# Altium schematic sheet 0159_V0P82A and V1P05A_.SchDoc
size 848 x 558 mm
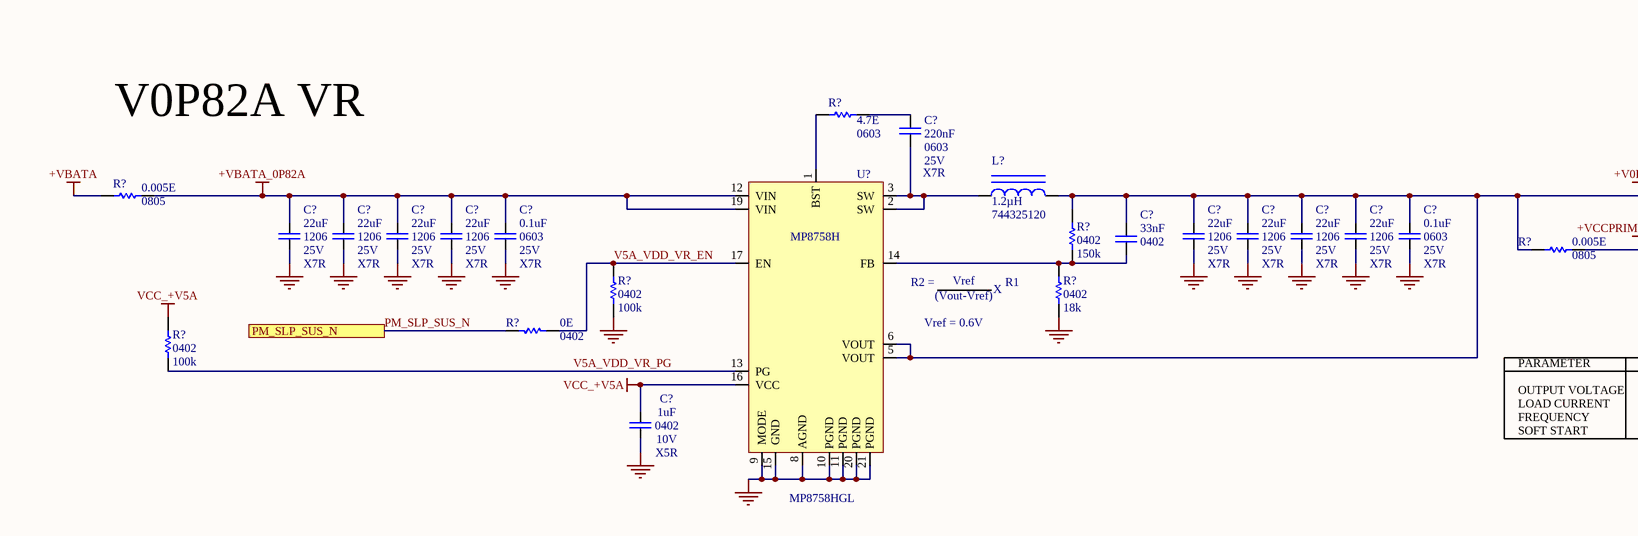
[diagram p0: 0159_V0P82A and V1P05A_.SchDoc, top left]
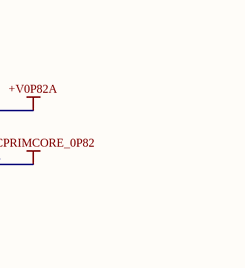
[diagram p1: 0159_V0P82A and V1P05A_.SchDoc, top middle]
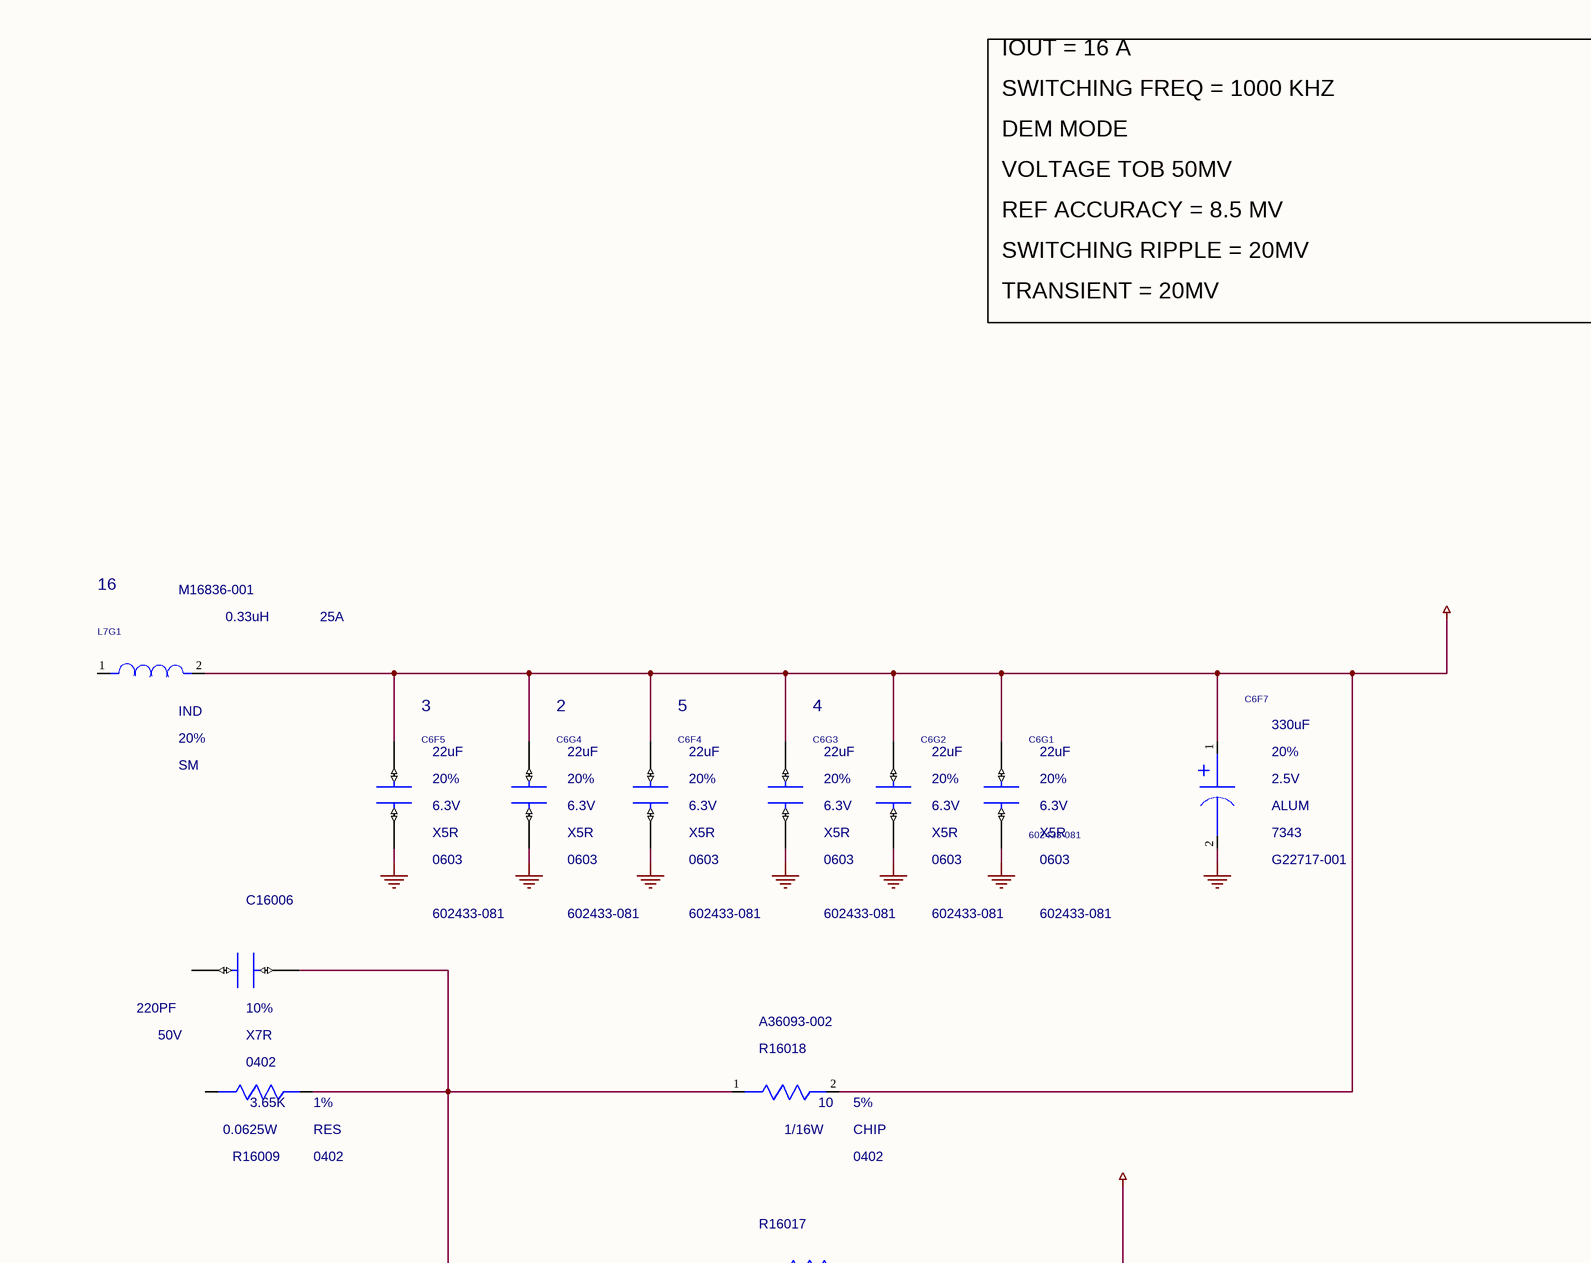
[diagram p2: 0159_V0P82A and V1P05A_.SchDoc, top right]
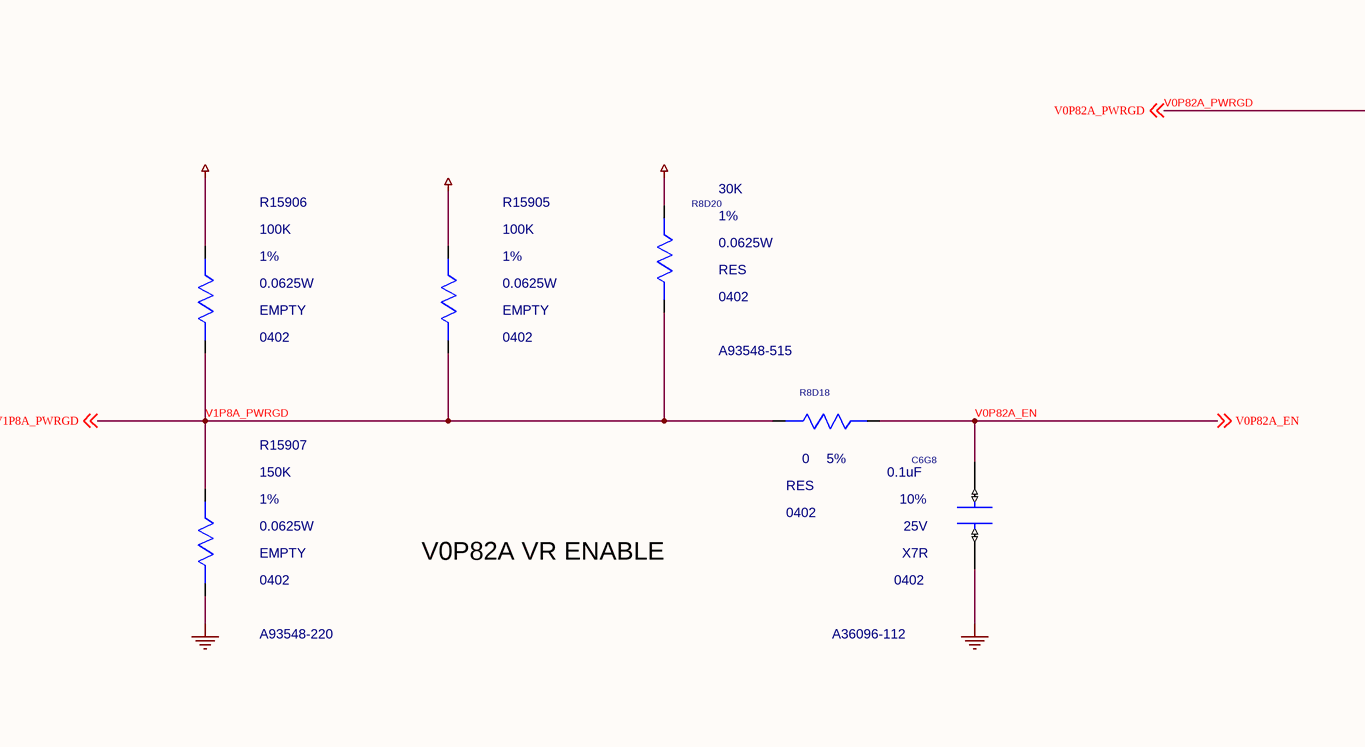
[diagram p3: 0159_V0P82A and V1P05A_.SchDoc, bottom left]
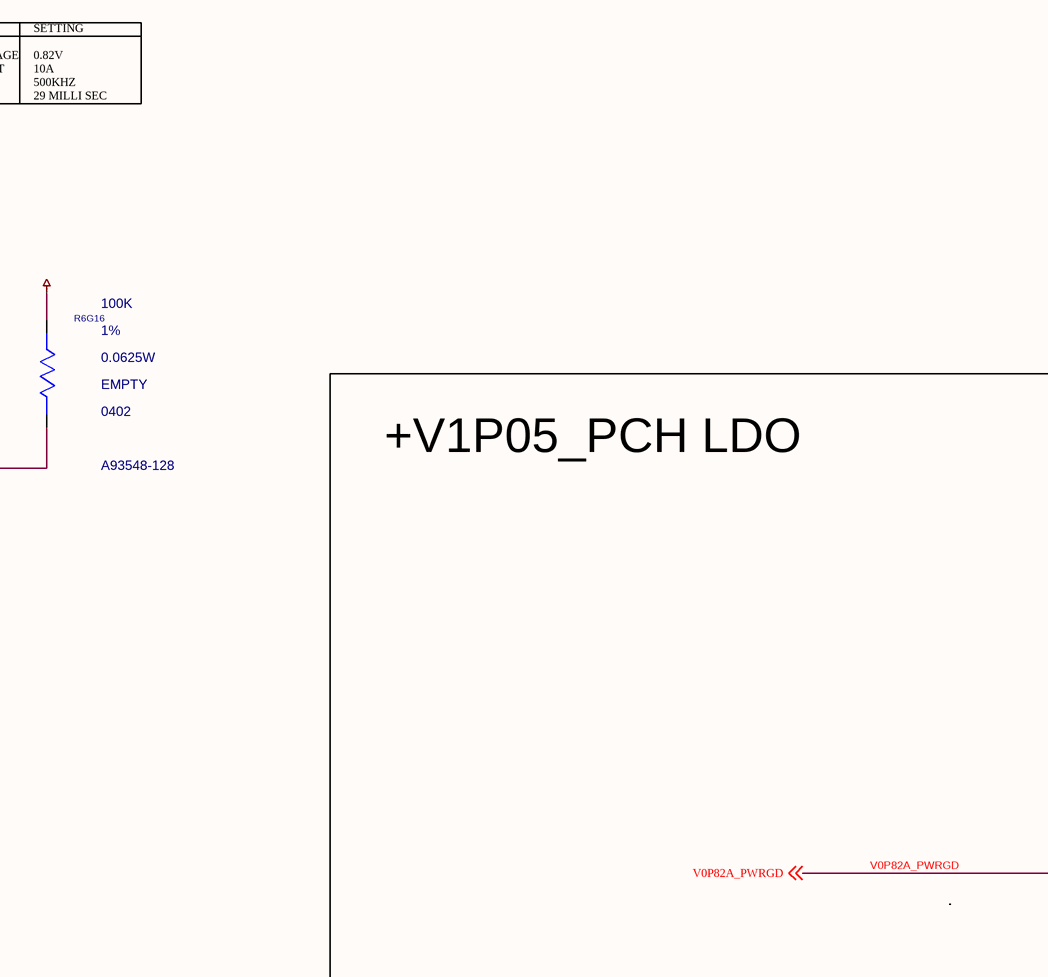
[diagram p4: 0159_V0P82A and V1P05A_.SchDoc, bottom middle]
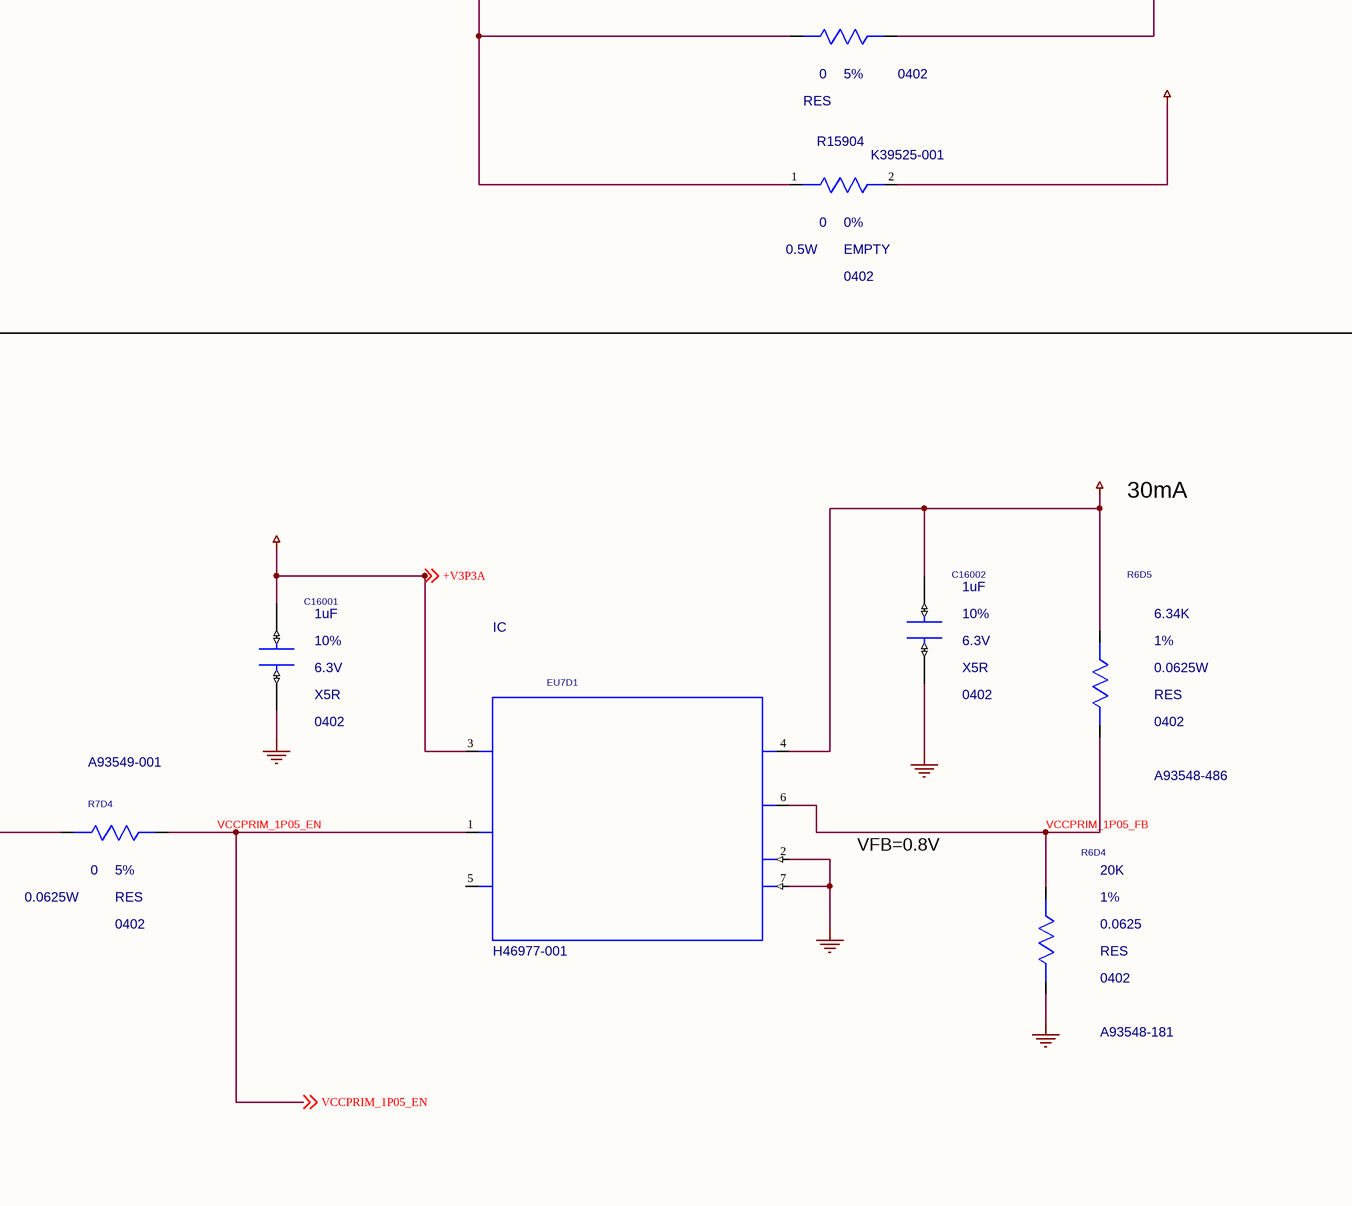
[diagram p5: 0159_V0P82A and V1P05A_.SchDoc, bottom right]

## Parts
(Parts that share a designator on the sheet are numbered #1, #2 ... from top to bottom, then left to right.)
C6F4  22uF  MATERIAL: X5R  PACK_TYPE: 0603  PART_NUMBER: 602433-081  TOLERANCE: 20%  VOLTAGE: 6.3V  REUSE_ID: 5  [CTK0_SM0603_1800X1000_MA]
C6F5  22uF  MATERIAL: X5R  PACK_TYPE: 0603  PART_NUMBER: 602433-081  TOLERANCE: 20%  VOLTAGE: 6.3V  REUSE_ID: 3  [CTK0_SM0603_1800X1000_MA]
C6F7  330uF  MATERIAL: ALUM  PACK_TYPE: 7343  PART_NUMBER: G22717-001  TOLERANCE: 20%  VOLTAGE: 2.5V  [TK0_SMC7343_7500X4500_ALEL_MA]
C6G1  22uF  MATERIAL: X5R  PACK_TYPE: 0603  PART_NUMBER: 602433-081  TOLERANCE: 20%  VOLTAGE: 6.3V  [CTK0_SM0603_1800X1000_MA]
C6G2  22uF  MATERIAL: X5R  PACK_TYPE: 0603  PART_NUMBER: 602433-081  TOLERANCE: 20%  VOLTAGE: 6.3V  [CTK0_SM0603_1800X1000_MA]
C6G3  22uF  MATERIAL: X5R  PACK_TYPE: 0603  PART_NUMBER: 602433-081  TOLERANCE: 20%  VOLTAGE: 6.3V  REUSE_ID: 4  [CTK0_SM0603_1800X1000_MA]
C6G4  22uF  MATERIAL: X5R  PACK_TYPE: 0603  PART_NUMBER: 602433-081  TOLERANCE: 20%  VOLTAGE: 6.3V  REUSE_ID: 2  [CTK0_SM0603_1800X1000_MA]
C6G8  0.1uF  MATERIAL: X7R  PACK_TYPE: 0402  PART_NUMBER: A36096-112  TOLERANCE: 10%  VOLTAGE: 25V  [CTK0_SM0402_1050X550_MA]
C16001  1uF  MATERIAL: X5R  PACK_TYPE: 0402  TOLERANCE: 10%  VOLTAGE: 6.3V  [CTK2_SM0402_1050X550_MA]
C16002  1uF  MATERIAL: X5R  PACK_TYPE: 0402  TOLERANCE: 10%  VOLTAGE: 6.3V  [CTK2_SM0402_1050X550_MA]
C16006  220PF  MATERIAL: X7R  PACK_TYPE: 0402  TOLERANCE: 10%  VOLTAGE: 50V  [CTK0_SM0402_1100X600_MA]
C?#1  value 220nF  Case/Package: 0603  Dielectric: X7R  Voltage: 25V  [CAPC0603]  (hidden comment: Cap)
C?#2  value 22uF  Case/Package: 1206  Voltage: 25V  Dielectric: X7R  [CAPC1206]
C?#3  value 22uF  Case/Package: 1206  Voltage: 25V  Dielectric: X7R  [CAPC1206]
C?#4  value 22uF  Case/Package: 1206  Voltage: 25V  Dielectric: X7R  [CAPC1206]
C?#5  value 22uF  Case/Package: 1206  Voltage: 25V  Dielectric: X7R  [CAPC1206]
C?#6  value 0.1uF  Case/Package: 0603  Voltage: 25V  Dielectric: X7R  [CAPC0603]
C?#7  value 22uF  Case/Package: 1206  Voltage: 25V  Dielectric: X7R  [CAPC1206]
C?#8  value 22uF  Case/Package: 1206  Voltage: 25V  Dielectric: X7R  [CAPC1206]
C?#9  value 22uF  Case/Package: 1206  Voltage: 25V  Dielectric: X7R  [CAPC1206]
C?#10  value 22uF  Case/Package: 1206  Voltage: 25V  Dielectric: X7R  [CAPC1206]
C?#11  value 0.1uF  Case/Package: 0603  Voltage: 25V  Dielectric: X7R  [CAPC0603]
C?#12  value 33nF  Case/Package: 0402  [CAPC0402]  (hidden comment: Cap)
C?#13  value 1uF  Case/Package: 0402  Voltage: 10V  Dielectric: X5R  [CAPC0402]
EU7D1  MATERIAL: IC  PART_NUMBER: H46977-001  [CTK0_LCC6_S2050_650_DF675X1225_MA]  (hidden comment: C_RT9053A_A)
L7G1  0.33uH  CURRENT: 25A  MATERIAL: IND  PACK_TYPE: SM  PART_NUMBER: M16836-001  TOLERANCE: 20%  REUSE_ID: 16  [CTK2_SM_7300X6800_MA]
L?  value 1.2µH  Manufacturer Part Number: 744325120  [IND-716530]  (hidden comment: C351096)
R6D4  20K  MATERIAL: RES  PACK_TYPE: 0402  PART_NUMBER: A93548-181  TOLERANCE: 1%  WATTAGE: 0.0625  [CTK0_SM0402_1100X550_MA]
R6D5  6.34K  MATERIAL: RES  PACK_TYPE: 0402  PART_NUMBER: A93548-486  TOLERANCE: 1%  WATTAGE: 0.0625W  [CTK0_SM0402_1100X550_MA]
R6G16  100K  MATERIAL: EMPTY  PACK_TYPE: 0402  PART_NUMBER: A93548-128  TOLERANCE: 1%  WATTAGE: 0.0625W  [CTK2_SM0402_1100X550_MA]
R7D4  0  MATERIAL: RES  PACK_TYPE: 0402  PART_NUMBER: A93549-001  TOLERANCE: 5%  WATTAGE: 0.0625W  [CTK0_SM0402_1100X550_MA]
R8D18  0  MATERIAL: RES  PACK_TYPE: 0402  TOLERANCE: 5%  [CTK0_SM0402_1100X550_MA]
R8D20  30K  MATERIAL: RES  PACK_TYPE: 0402  PART_NUMBER: A93548-515  TOLERANCE: 1%  WATTAGE: 0.0625W  [CTK0_SM0402_1100X550_MA]
R15904  0  MATERIAL: EMPTY  PACK_TYPE: 0402  PART_NUMBER: K39525-001  TOLERANCE: 0%  WATTAGE: 0.5W  [SMR0402ME]
R15905  100K  MATERIAL: EMPTY  PACK_TYPE: 0402  TOLERANCE: 1%  WATTAGE: 0.0625W  [CTK0_SM0402_1100X550_MA]
R15906  100K  MATERIAL: EMPTY  PACK_TYPE: 0402  TOLERANCE: 1%  WATTAGE: 0.0625W  [CTK0_SM0402_1100X550_MA]
R15907  150K  MATERIAL: EMPTY  PACK_TYPE: 0402  PART_NUMBER: A93548-220  TOLERANCE: 1%  WATTAGE: 0.0625W  [CTK2_SM0402_1100X550_MA]
R16009  3.65K  MATERIAL: RES  PACK_TYPE: 0402  TOLERANCE: 1%  WATTAGE: 0.0625W  [CTK2_SM0402_1100X550_MA]
R16017  0  MATERIAL: RES  PACK_TYPE: 0402  TOLERANCE: 5%  [CTK0_SM0402_1100X550_MA]
R16018  10  MATERIAL: CHIP  PACK_TYPE: 0402  PART_NUMBER: A36093-002  TOLERANCE: 5%  WATTAGE: 1/16W  [SMR0402IA]
R?#1  value 4.7E  Case/Package: 0603  [RESC0603]  (hidden comment: Res)
R?#2  value 0.005E  Case/Package: 0805  [RESC0805]  (hidden comment: Res)
R?#3  value 150k  Case/Package: 0402  [RESC0402]  (hidden comment: Res)
R?#4  value 0.005E  Case/Package: 0805  [RESC0805]  (hidden comment: Res)
R?#5  value 100k  Case/Package: 0402  [RESC0402]  (hidden comment: Res)
R?#6  value 18k  Case/Package: 0402  [RESC0402]  (hidden comment: Res)
R?#7  value 0E  Case/Package: 0402  [RESC0402]  (hidden comment: Res)
R?#8  value 100k  Case/Package: 0402  [RESC0402]  (hidden comment: Res)
U?  Manufacturer Part Number: MP8758HGL  [MP8758H_QFN-21 (3mmx4mm)]  (hidden comment: MP8758H)

## Ports
PM_SLP_SUS_N

## Nets
+V0P82A: C6F4.1(A) C6F5.1(A) C6F7.1(A) C6G1.1(A) C6G2.1(A) C6G3.1(A) C6G4.1(A) C?#7.2 C?#8.2 C?#9.2 C?#10.2 C?#11.2 C?#12.2 L7G1.2(INB) L?.2 R16018.2(B) R?#3.1 R?#4.1 U?.5(VOUT) U?.6(VOUT)
+V1P05A_PCH: C16002.1(A) EU7D1.4(VOUT) R6D5.1(A)
+V1P8A_SW_R: R15905.1(A)
+V1P8A_VCC: R15906.1(A)
+V3P3A: C16001.1(A) EU7D1.3(VIN) R6G16.1(A) R8D20.1(A) ; off-sheet +V3P3A
+VBATA: R?#2.1
+VBATA_0P82A: C?#2.2 C?#3.2 C?#4.2 C?#5.2 C?#6.2 R?#2.2 U?.12(VIN) U?.19(VIN)
+VCCHSIO_0P82: R15904.2(B)
+VCCPRIMCORE_0P82: R16017.2(B) R?#4.2
GND: C6F4.2(B) C6F5.2(B) C6F7.2(B) C6G1.2(B) C6G2.2(B) C6G3.2(B) C6G4.2(B) C6G8.2(B) C16001.2(B) C16002.2(B) C?#2.1 C?#3.1 C?#4.1 C?#5.1 C?#6.1 C?#7.1 C?#8.1 C?#9.1 C?#10.1 C?#11.1 C?#13.1 EU7D1.2(GND) EU7D1.7(GND_TPD) R6D4.2(B) R15907.2(B) R?#5.2 R?#6.2 U?.8(AGND) U?.9(MODE) U?.10(PGND) U?.11(PGND) U?.15(GND) U?.20(PGND) U?.21(PGND)
VCC_+V5A: C?#13.2 R?#8.1 U?.16(VCC)
PM_SLP_SUS_N: R?#7.2 ; port PM_SLP_SUS_N
UNNAMED_528_CCAP_I745_B: C16006.2(B) R15904.1(A) R16009.2(B) R16017.1(A) R16018.1(A)
V0P82A_EN: C6G8.1(A) R8D18.2(B) ; off-sheet V0P82A_EN
V0P82A_PWRGD: R6G16.2(B) R7D4.1(A) ; off-sheet V0P82A_PWRGD
V1P8A_PWRGD: R8D18.1(A) R8D20.2(B) R15905.2(B) R15906.2(B) R15907.1(A) ; off-sheet V1P8A_PWRGD
V5A_VDD_VR_EN: R?#5.1 R?#7.1 U?.17(EN)
V5A_VDD_VR_PG: R?#8.2 U?.13(PG)
VCCPRIM_1P05_EN: EU7D1.1(EN) R7D4.2(B) ; off-sheet VCCPRIM_1P05_EN
VCCPRIM_1P05_FB: EU7D1.6(FB) R6D4.1(A) R6D5.2(B)
NetC?#1_1: C?#1.1 L?.1 U?.2(SW) U?.3(SW)
NetC?#1_2: C?#1.2 R?#1.2
NetC?#12_1: C?#12.1 R?#3.2 R?#6.1 U?.14(FB)
NetR?#1_1: R?#1.1 U?.1(BST)

Not connected (* = marked no-connect by the designer): C16006 1(A); EU7D1 5(NC); L7G1 1(INA); R16009 1(A)

## Notes on the sheet
- SWITCHING FREQ = 1000 KHZ
- IOUT = 16 A
- VOLTAGE TOB 50MV
- DEM MODE
- REF ACCURACY = 8.5 MV
- SWITCHING RIPPLE = 20MV
- TRANSIENT = 20MV
- V0P82A VR
- (near U?) R2 =
- (near U?) Vref = 0.6V
- Vref
- (Vout-Vref)
- X
- (near R?#6) R1
- PARAMETER
- OUTPUT VOLTAGE
- LOAD CURRENT
- SETTING
- 10A
- 0.82V
- FREQUENCY
- SOFT START
- 500KHZ
- 29 MILLI SEC
- +V1P05_PCH LDO
- 30mA
- V0P82A VR ENABLE
- VFB=0.8V

## Library data of the parts
C6F4 = C_CAP: CDS_PHYS_PART_NAME: C_CAP_0603-602433-081,X5R,22UF,6.3V,20%,TK0,GENERIC; CDS_LMAN_SYM_OUTLINE: -50,50,50,-50; FP_TECH: TK0; IP: GENERIC; ROOM: NONE; OriginalSymbolOrigin: (-50,25); XY: (5975,-400); VER: 1; ROT: 0; PHYS_PAGE: 159; LOCATION: C6F4; DRAWING: @RVP1_ADL_SB_ADP_S_DDR5_SODIMM_2DPC_LIB.H55_DG2_2DPC(SCH_1):PAGE528; CDS_LIB: c_discrete; VARIANT: ?; PCB Footprint: CTK0_SM0603_1800X1000_MA; CHIPS_PART_NAME: C_CAP; CDS_PART_NAME: C_CAP_0603-602433-081,X5R,22UF,6.3V,20%,TK0,GENERIC; CDS_LOCATION: C6F4; ASI_MODEL: 602433-081
C6F5 = C_CAP: CDS_PHYS_PART_NAME: C_CAP_0603-602433-081,X5R,22UF,6.3V,20%,TK0,GENERIC; CDS_LMAN_SYM_OUTLINE: -50,50,50,-50; FP_TECH: TK0; IP: GENERIC; ROOM: NONE; OriginalSymbolOrigin: (-50,25); XY: (5500,-400); VER: 1; ROT: 0; PHYS_PAGE: 159; LOCATION: C6F5; DRAWING: @RVP1_ADL_SB_ADP_S_DDR5_SODIMM_2DPC_LIB.H55_DG2_2DPC(SCH_1):PAGE528; CDS_LIB: c_discrete; VARIANT: ?; PCB Footprint: CTK0_SM0603_1800X1000_MA; CHIPS_PART_NAME: C_CAP; CDS_PART_NAME: C_CAP_0603-602433-081,X5R,22UF,6.3V,20%,TK0,GENERIC; CDS_LOCATION: C6F5; ASI_MODEL: 602433-081
C6F7 = CAPP_2: CDS_PHYS_PART_NAME: CAPP_2_7343-G22717-001,ALUM,330UF,2.5V,20%,TK0,GENERIC; BOM_USE: STUFF; CDS_LMAN_SYM_OUTLINE: -50,100,50,-50; FP_TECH: TK0; IP: GENERIC; ROOM: NONE; OriginalSymbolOrigin: (-50,75); XY: (7025,-400); VER: 1; ROT: 0; PHYS_PAGE: 159; LOCATION: C6F7; DRAWING: @RVP1_ADL_SB_ADP_S_DDR5_SODIMM_2DPC_LIB.H55_DG2_2DPC(SCH_1):PAGE528; CDS_LIB: discrete_2; VARIANT: ?; PCB Footprint: TK0_SMC7343_7500X4500_ALEL_MA; CHIPS_PART_NAME: CAPP_2; CDS_PART_NAME: CAPP_2_7343-G22717-001,ALUM,330UF,2.5V,20%,TK0,GENERIC; CDS_LOCATION: C6F7; ASI_MODEL: G22717-001
C6G1 = C_CAP: CDS_PHYS_PART_NAME: C_CAP_0603-602433-081,X5R,22UF,6.3V,20%,TK0,GENERIC; CDS_LMAN_SYM_OUTLINE: -50,50,50,-50; FP_TECH: TK0; IP: GENERIC; ROOM: NONE; OriginalSymbolOrigin: (-50,25); XY: (6625,-400); VER: 1; ROT: 0; PHYS_PAGE: 159; LOCATION: C6G1; DRAWING: @RVP1_ADL_SB_ADP_S_DDR5_SODIMM_2DPC_LIB.H55_DG2_2DPC(SCH_1):PAGE528; CDS_LIB: c_discrete; VARIANT: ?; PCB Footprint: CTK0_SM0603_1800X1000_MA; CHIPS_PART_NAME: C_CAP; CDS_PART_NAME: C_CAP_0603-602433-081,X5R,22UF,6.3V,20%,TK0,GENERIC; CDS_LOCATION: C6G1; ASI_MODEL: 602433-081
C6G2 = C_CAP: CDS_PHYS_PART_NAME: C_CAP_0603-602433-081,X5R,22UF,6.3V,20%,TK0,GENERIC; CDS_LMAN_SYM_OUTLINE: -50,50,50,-50; FP_TECH: TK0; IP: GENERIC; ROOM: NONE; OriginalSymbolOrigin: (-50,25); XY: (6425,-400); VER: 1; ROT: 0; PHYS_PAGE: 159; LOCATION: C6G2; DRAWING: @RVP1_ADL_SB_ADP_S_DDR5_SODIMM_2DPC_LIB.H55_DG2_2DPC(SCH_1):PAGE528; CDS_LIB: c_discrete; VARIANT: ?; PCB Footprint: CTK0_SM0603_1800X1000_MA; CHIPS_PART_NAME: C_CAP; CDS_PART_NAME: C_CAP_0603-602433-081,X5R,22UF,6.3V,20%,TK0,GENERIC; CDS_LOCATION: C6G2; ASI_MODEL: 602433-081
C6G3 = C_CAP: CDS_PHYS_PART_NAME: C_CAP_0603-602433-081,X5R,22UF,6.3V,20%,TK0,GENERIC; CDS_LMAN_SYM_OUTLINE: -50,50,50,-50; FP_TECH: TK0; IP: GENERIC; ROOM: NONE; OriginalSymbolOrigin: (-50,25); XY: (6225,-400); VER: 1; ROT: 0; PHYS_PAGE: 159; LOCATION: C6G3; DRAWING: @RVP1_ADL_SB_ADP_S_DDR5_SODIMM_2DPC_LIB.H55_DG2_2DPC(SCH_1):PAGE528; CDS_LIB: c_discrete; VARIANT: ?; PCB Footprint: CTK0_SM0603_1800X1000_MA; CHIPS_PART_NAME: C_CAP; CDS_PART_NAME: C_CAP_0603-602433-081,X5R,22UF,6.3V,20%,TK0,GENERIC; CDS_LOCATION: C6G3; ASI_MODEL: 602433-081
C6G4 = C_CAP: CDS_PHYS_PART_NAME: C_CAP_0603-602433-081,X5R,22UF,6.3V,20%,TK0,GENERIC; CDS_LMAN_SYM_OUTLINE: -50,50,50,-50; FP_TECH: TK0; IP: GENERIC; ROOM: NONE; OriginalSymbolOrigin: (-50,25); XY: (5750,-400); VER: 1; ROT: 0; PHYS_PAGE: 159; LOCATION: C6G4; DRAWING: @RVP1_ADL_SB_ADP_S_DDR5_SODIMM_2DPC_LIB.H55_DG2_2DPC(SCH_1):PAGE528; CDS_LIB: c_discrete; VARIANT: ?; PCB Footprint: CTK0_SM0603_1800X1000_MA; CHIPS_PART_NAME: C_CAP; CDS_PART_NAME: C_CAP_0603-602433-081,X5R,22UF,6.3V,20%,TK0,GENERIC; CDS_LOCATION: C6G4; ASI_MODEL: 602433-081
C6G8 = C_CAP: CDS_PHYS_PART_NAME: C_CAP_0402-A36096-112,X7R,0.1UF,25V,10%,TK0,GENERIC; CDS_LMAN_SYM_OUTLINE: -50,50,50,-50; FP_TECH: TK0; IP: GENERIC; ROOM: NONE; OriginalSymbolOrigin: (-50,25); XY: (2125,-2750); VER: 1; ROT: 2; PHYS_PAGE: 159; LOCATION: C6G8; DRAWING: @RVP1_ADL_SB_ADP_S_DDR5_SODIMM_2DPC_LIB.H55_DG2_2DPC(SCH_1):PAGE528; CDS_LIB: c_discrete; VARIANT: ?; PCB Footprint: CTK0_SM0402_1050X550_MA; CHIPS_PART_NAME: C_CAP; CDS_PART_NAME: C_CAP_0402-A36096-112,X7R,0.1UF,25V,10%,TK0,GENERIC; CDS_LOCATION: C6G8; ASI_MODEL: A36096-112
C16001 = C_CAP: PART_NUMBER: A36096-027; CDS_PHYS_PART_NAME: CAP_402-1UF,10%,16V"; CDS_PART_NAME: C_CAP_0402-A36096-027,X5R,1UF,6.3V,10%,TK2,GENERIC; CDS_LMAN_SYM_OUTLINE: -50,50,50,-50; FP_TECH: TK2; IP: GENERIC; ROOM: NONE; OriginalSymbolOrigin: (-50,25); XY: (5225,-2425); VER: 1; ROT: 0; PHYS_PAGE: 159; LOCATION: C16001; DRAWING: @RVP1_ADL_SB_ADP_S_DDR5_SODIMM_2DPC_LIB.H55_DG2_2DPC(SCH_1):PAGE528; CDS_LIB: c_discrete; VARIANT: ?; PCB Footprint: CTK2_SM0402_1050X550_MA; CHIPS_PART_NAME: C_CAP; CDS_LOCATION: C16001; ASI_MODEL: A36096-027
C16002 = C_CAP: PART_NUMBER: A36096-027; CDS_PHYS_PART_NAME: CAP_402-1UF,10%,16V"; CDS_PART_NAME: C_CAP_0402-A36096-027,X5R,1UF,6.3V,10%,TK2,GENERIC; CDS_LMAN_SYM_OUTLINE: -50,50,50,-50; FP_TECH: TK2; IP: GENERIC; ROOM: NONE; OriginalSymbolOrigin: (-50,25); XY: (6425,-2375); VER: 1; ROT: 0; PHYS_PAGE: 159; LOCATION: C16002; DRAWING: @RVP1_ADL_SB_ADP_S_DDR5_SODIMM_2DPC_LIB.H55_DG2_2DPC(SCH_1):PAGE528; CDS_LIB: c_discrete; VARIANT: ?; PCB Footprint: CTK2_SM0402_1050X550_MA; CHIPS_PART_NAME: C_CAP; CDS_LOCATION: C16002; ASI_MODEL: A36096-027
C16006 = C_CAP#1: PART_NUMBER: A36096-002; CHIPS_PART_NAME: C_CAP; CDS_PHYS_PART_NAME: C_CAP_0402-A36096-002,X7R,220PF,50V,10%,TK0,GENERIC; CDS_LMAN_SYM_OUTLINE: -50,50,50,-50; FP_TECH: TK0; IP: GENERIC; ROOM: NONE; OriginalSymbolOrigin: (-25,50); XY: (5225,-725); VER: 2; ROT: 0; PHYS_PAGE: 159; LOCATION: C16006; DRAWING: @RVP1_ADL_SB_ADP_S_DDR5_SODIMM_2DPC_LIB.H55_DG2_2DPC(SCH_1):PAGE528; CDS_LIB: c_discrete; VARIANT: ?; PCB Footprint: CTK0_SM0402_1100X600_MA; CDS_PART_NAME: C_CAP_0402-A36096-002,X7R,220PF,50V,10%,TK0,GENERIC; CDS_LOCATION: C16006
C?#1 = Cap: CAP CER 220nF 25V X7R 0603; Manufacturer Part Number: GRM188R71E224KA88D
C?#2-C?#5 C?#7-C?#10 = Cap: CAP CER 22uF 25V X7R 1206; Manufacturer Part Number: CL31A226KAHNNNE
C?#6 C?#11 = Cap: CAP CER 0.1uF 25V X7R 0603; Manufacturer Part Number: CL10B104KA8NNND
C?#12 = Cap: CAP CER 33nF 25V X7R 0402; Manufacturer Part Number: C0402C333K3REC; Dielectric: X7R; Voltage: 25V
C?#13 = Cap: CAP CER 1uF 10V X5R 0402
EU7D1 = C_RT9053A_A: CDS_PHYS_PART_NAME: C_RT9053A_A_LCC-H46977-001,IC,RT9053AZQW,TK0,GENERIC; CDS_LMAN_SYM_OUTLINE: -250,250,250,-200; FP_TECH: TK0; IP: GENERIC; PACK_TYPE: LCC; ROOM: NONE; OriginalSymbolOrigin: (-275,250); XY: (5875,-2750); VER: 1; ROT: 0; PHYS_PAGE: 159; LOCATION: EU7D1; DRAWING: @RVP1_ADL_SB_ADP_S_DDR5_SODIMM_2DPC_LIB.H55_DG2_2DPC(SCH_1):PAGE528; CDS_LIB: local; VARIANT: ?; PCB Footprint: CTK0_LCC6_S2050_650_DF675X1225_MA; SEC_TYPE: LCC; CHIPS_PART_NAME: C_RT9053A_A; CDS_PART_NAME: C_RT9053A_A_LCC-H46977-001,IC,RT9053AZQW,TK0,GENERIC; CDS_LOCATION: EU7D1; ASI_MODEL: H46977-001
L7G1 = C_INDUCTOR: CDS_PHYS_PART_NAME: C_INDUCTOR_SM-M16836-001,IND,0.33UH,20%,25A,TK2,GENERIC; CDS_LMAN_SYM_OUTLINE: -100,50,100,-50; FP_TECH: TK2; IP: GENERIC; ROOM: NONE; OriginalSymbolOrigin: (-75,25); XY: (5050,-175); VER: 1; ROT: 0; PHYS_PAGE: 159; LOCATION: L7G1; DRAWING: @RVP1_ADL_SB_ADP_S_DDR5_SODIMM_2DPC_LIB.H55_DG2_2DPC(SCH_1):PAGE528; CDS_LIB: local; VARIANT: ?; PCB Footprint: CTK2_SM_7300X6800_MA; CHIPS_PART_NAME: C_INDUCTOR; CDS_PART_NAME: C_INDUCTOR_SM-M16836-001,IND,0.33UH,20%,25A,TK2,GENERIC; CDS_LOCATION: L7G1; ASI_MODEL: M16836-001
L? = Inductor: Power Inductors 1.2uH, 20A,1.8mΩ,111005; Case/Package: IND-11mm×10.2mm
R6D4 = C_RES: CDS_PHYS_PART_NAME: C_RES_0402-A93548-181,RES,20K,1%,0.0625,TK0,GENERIC; CDS_LMAN_SYM_OUTLINE: -50,50,50,-50; FP_TECH: TK0; IP: GENERIC; ROOM: NONE; OriginalSymbolOrigin: (-25,75); XY: (6650,-2950); VER: 2; ROT: 0; PHYS_PAGE: 159; LOCATION: R6D4; DRAWING: @RVP1_ADL_SB_ADP_S_DDR5_SODIMM_2DPC_LIB.H55_DG2_2DPC(SCH_1):PAGE528; CDS_LIB: c_discrete; VARIANT: ?; PCB Footprint: CTK0_SM0402_1100X550_MA; SEC_TYPE: 0402; CHIPS_PART_NAME: C_RES; CDS_PART_NAME: C_RES_0402-A93548-181,RES,20K,1%,0.0625,TK0,GENERIC; CDS_LOCATION: R6D4; ASI_MODEL: A93548-181
R6D5 = C_RES: CDS_PHYS_PART_NAME: C_RES_0402-A93548-486,RES,6.34K,1%,0.0625W,TK0,GENERIC; CDS_LMAN_SYM_OUTLINE: -50,50,50,-50; FP_TECH: TK0; IP: GENERIC; ROOM: NONE; OriginalSymbolOrigin: (-25,75); XY: (6750,-2475); VER: 2; ROT: 0; PHYS_PAGE: 159; LOCATION: R6D5; DRAWING: @RVP1_ADL_SB_ADP_S_DDR5_SODIMM_2DPC_LIB.H55_DG2_2DPC(SCH_1):PAGE528; CDS_LIB: c_discrete; VARIANT: ?; PCB Footprint: CTK0_SM0402_1100X550_MA; SEC_TYPE: 0402; CHIPS_PART_NAME: C_RES; CDS_PART_NAME: C_RES_0402-A93548-486,RES,6.34K,1%,0.0625W,TK0,GENERIC; CDS_LOCATION: R6D5; ASI_MODEL: A93548-486
R6G16 = C_RES: CDS_PHYS_PART_NAME: C_RES_0402-A93548-128,EMPTY,100K,1%,0.0625W,TK2,GENERIC; CDS_LMAN_SYM_OUTLINE: -50,50,50,-50; FP_TECH: TK2; IP: GENERIC; ROOM: NONE; OriginalSymbolOrigin: (-25,75); XY: (2875,-1825); VER: 2; ROT: 0; PHYS_PAGE: 159; LOCATION: R6G16; DRAWING: @RVP1_ADL_SB_ADP_S_DDR5_SODIMM_2DPC_LIB.H55_DG2_2DPC(SCH_1):PAGE528; CDS_LIB: c_discrete; VARIANT: ?; PCB Footprint: CTK2_SM0402_1100X550_MA; CHIPS_PART_NAME: C_RES; CDS_PART_NAME: C_RES_0402-A93548-128,EMPTY,100K,1%,0.0625W,TK2,GENERIC; CDS_LOCATION: R6G16; ASI_MODEL: A93548-128
R7D4 = C_RES#1: CHIPS_PART_NAME: C_RES; CDS_PHYS_PART_NAME: C_RES_0402-A93549-001,RES,0,5%,0.0625W,TK0,GENERIC; CDS_LMAN_SYM_OUTLINE: -50,50,50,-50; FP_TECH: TK0; IP: GENERIC; ROOM: NONE; OriginalSymbolOrigin: (-75,25); XY: (4925,-2750); VER: 1; PHYS_PAGE: 159; LOCATION: R7D4; DRAWING: @RVP1_ADL_SB_ADP_S_DDR5_SODIMM_2DPC_LIB.H55_DG2_2DPC(SCH_1):PAGE528; CDS_LIB: c_discrete; VARIANT: ?; PCB Footprint: CTK0_SM0402_1100X550_MA; SEC_TYPE: 0402; ROT: 0; CDS_PART_NAME: C_RES_0402-A93549-001,RES,0,5%,0.0625W,TK0,GENERIC; CDS_LOCATION: R7D4; ASI_MODEL: A93549-001
R8D18 = C_RES#1: PART_NUMBER: A93549-001; CHIPS_PART_NAME: C_RES; CDS_PHYS_PART_NAME: RES_402-0,5%,402"; CDS_PART_NAME: C_RES_0402-A93549-001,RES,0,5%,0.0625W,TK0,GENERIC; CDS_LMAN_SYM_OUTLINE: -50,50,50,-50; FP_TECH: TK0; IP: GENERIC; ROOM: NONE; WATTAGE: 0.0625W; OriginalSymbolOrigin: (-75,25); XY: (1850,-2575); VER: 1; PHYS_PAGE: 159; LOCATION: R8D18; DRAWING: @RVP1_ADL_SB_ADP_S_DDR5_SODIMM_2DPC_LIB.H55_DG2_2DPC(SCH_1):PAGE528; CDS_LIB: c_discrete; VARIANT: ?; PCB Footprint: CTK0_SM0402_1100X550_MA; SEC_TYPE: 0402; ROT: 0; CDS_LOCATION: R8D18; ASI_MODEL: A93549-001
R8D20 = C_RES: CDS_PHYS_PART_NAME: RES_402-22K,5%,402"; CDS_PART_NAME: C_RES_0402-A93548-515,RES,30K,1%,0.0625W,TK0,GENERIC; CDS_LMAN_SYM_OUTLINE: -50,50,50,-50; FP_TECH: TK0; IP: GENERIC; ROOM: NONE; OriginalSymbolOrigin: (-25,75); XY: (1550,-2275); VER: 2; ROT: 0; PHYS_PAGE: 159; LOCATION: R8D20; DRAWING: @RVP1_ADL_SB_ADP_S_DDR5_SODIMM_2DPC_LIB.H55_DG2_2DPC(SCH_1):PAGE528; CDS_LIB: c_discrete; BOM: GLUE_OPTION; VARIANT: ?; PCB Footprint: CTK0_SM0402_1100X550_MA; SEC_TYPE: 0402; CHIPS_PART_NAME: C_RES; CDS_LOCATION: R8D20; ASI_MODEL: A93548-515
R15904 = RES#1: CHIPS_PART_NAME: RES; CDS_PHYS_PART_NAME: RES_0402-K39525-001,EMPTY,0,0%,0.5W,LPDB,GENERIC; OriginalSymbolOrigin: (-75,25); XY: (6275,-1550); VER: 1; PHYS_PAGE: 159; LOCATION: R15904; IP: GENERIC; FP_TECH: LPDB; DRAWING: @RVP1_ADL_SB_ADP_S_DDR5_SODIMM_2DPC_LIB.H55_DG2_2DPC(SCH_1):PAGE528; CDS_LIB: discrete; PCB Footprint: SMR0402ME; ROT: 0; CDS_PART_NAME: RES_0402-K39525-001,EMPTY,0,0%,0.5W,LPDB,GENERIC; CDS_LOCATION: R15904
R15905 = C_RES: PART_NUMBER: A93548-128; CDS_PHYS_PART_NAME: C_RES_0402-A93548-128,EMPTY,100K,1%,0.0625W,TK0,GENERIC; CDS_LMAN_SYM_OUTLINE: -50,50,50,-50; FP_TECH: TK0; IP: GENERIC; ROOM: NONE; OriginalSymbolOrigin: (-25,75); XY: (1150,-2350); VER: 2; ROT: 0; PHYS_PAGE: 159; LOCATION: R15905; DRAWING: @RVP1_ADL_SB_ADP_S_DDR5_SODIMM_2DPC_LIB.H55_DG2_2DPC(SCH_1):PAGE528; CDS_LIB: c_discrete; VARIANT: ?; PCB Footprint: CTK0_SM0402_1100X550_MA; CHIPS_PART_NAME: C_RES; CDS_PART_NAME: C_RES_0402-A93548-128,EMPTY,100K,1%,0.0625W,TK0,GENERIC; CDS_LOCATION: R15905; ASI_MODEL: A93548-128
R15906 = C_RES: PART_NUMBER: A93548-128; CDS_PHYS_PART_NAME: C_RES_0402-A93548-128,EMPTY,100K,1%,0.0625W,TK0,GENERIC; CDS_LMAN_SYM_OUTLINE: -50,50,50,-50; FP_TECH: TK0; IP: GENERIC; ROOM: NONE; OriginalSymbolOrigin: (-25,75); XY: (700,-2350); VER: 2; ROT: 0; PHYS_PAGE: 159; LOCATION: R15906; DRAWING: @RVP1_ADL_SB_ADP_S_DDR5_SODIMM_2DPC_LIB.H55_DG2_2DPC(SCH_1):PAGE528; CDS_LIB: c_discrete; VARIANT: ?; PCB Footprint: CTK0_SM0402_1100X550_MA; CHIPS_PART_NAME: C_RES; CDS_PART_NAME: C_RES_0402-A93548-128,EMPTY,100K,1%,0.0625W,TK0,GENERIC; CDS_LOCATION: R15906; ASI_MODEL: A93548-128
R15907 = C_RES: CDS_PHYS_PART_NAME: C_RES_0402-A93548-220,EMPTY,150K,1%,0.0625W,TK2,GENERIC; CDS_LMAN_SYM_OUTLINE: -50,50,50,-50; FP_TECH: TK2; IP: GENERIC; ROOM: NONE; OriginalSymbolOrigin: (-25,75); XY: (700,-2800); VER: 2; ROT: 0; PHYS_PAGE: 159; LOCATION: R15907; DRAWING: @RVP1_ADL_SB_ADP_S_DDR5_SODIMM_2DPC_LIB.H55_DG2_2DPC(SCH_1):PAGE528; CDS_LIB: c_discrete; VARIANT: ?; PCB Footprint: CTK2_SM0402_1100X550_MA; CHIPS_PART_NAME: C_RES; CDS_PART_NAME: C_RES_0402-A93548-220,EMPTY,150K,1%,0.0625W,TK2,GENERIC; CDS_LOCATION: R15907
R16009 = C_RES#1: PART_NUMBER: A93548-065; CHIPS_PART_NAME: C_RES; CDS_PHYS_PART_NAME: C_RES_0402-A93548-065,RES,3.65K,1%,0.0625W,TK2,GENERIC; CDS_LMAN_SYM_OUTLINE: -50,50,50,-50; FP_TECH: TK2; IP: GENERIC; ROOM: NONE; OriginalSymbolOrigin: (-75,25); XY: (5250,-950); VER: 1; ROT: 0; PHYS_PAGE: 159; LOCATION: R16009; DRAWING: @RVP1_ADL_SB_ADP_S_DDR5_SODIMM_2DPC_LIB.H55_DG2_2DPC(SCH_1):PAGE528; CDS_LIB: c_discrete; VARIANT: ?; PCB Footprint: CTK2_SM0402_1100X550_MA; CDS_PART_NAME: C_RES_0402-A93548-065,RES,3.65K,1%,0.0625W,TK2,GENERIC; CDS_LOCATION: R16009
R16017 = C_RES#1: PART_NUMBER: A93549-001; CHIPS_PART_NAME: C_RES; CDS_PHYS_PART_NAME: C_RES_0402-A93549-001,RES,0,5%,0.0625W,TK0,GENERIC; CDS_LMAN_SYM_OUTLINE: -50,50,50,-50; FP_TECH: TK0; IP: GENERIC; ROOM: NONE; WATTAGE: 0.0625W; OriginalSymbolOrigin: (-75,25); XY: (6275,-1275); VER: 1; PHYS_PAGE: 159; LOCATION: R16017; DRAWING: @RVP1_ADL_SB_ADP_S_DDR5_SODIMM_2DPC_LIB.H55_DG2_2DPC(SCH_1):PAGE528; CDS_LIB: c_discrete; VARIANT: ?; PCB Footprint: CTK0_SM0402_1100X550_MA; ROT: 0; CDS_PART_NAME: C_RES_0402-A93549-001,RES,0,5%,0.0625W,TK0,GENERIC; CDS_LOCATION: R16017; ASI_MODEL: A93549-001
R16018 = RES#1: CHIPS_PART_NAME: RES; CDS_PHYS_PART_NAME: RES_0402-A36093-002,CHIP,10,5%,1/16W,LPDB,GENERIC; OriginalSymbolOrigin: (-75,25); XY: (6225,-950); VER: 1; ROT: 0; PHYS_PAGE: 159; LOCATION: R16018; IP: GENERIC; FP_TECH: LPDB; DRAWING: @RVP1_ADL_SB_ADP_S_DDR5_SODIMM_2DPC_LIB.H55_DG2_2DPC(SCH_1):PAGE528; CDS_LIB: discrete; PCB Footprint: SMR0402IA; CDS_PART_NAME: RES_0402-A36093-002,CHIP,10,5%,1/16W,LPDB,GENERIC; CDS_LOCATION: R16018
R?#1 = Res: Thick Film Resistor -  4.7ohm, 1%, 0603; Manufacturer Part Number: RL0603FR-074R7L
R?#2 R?#4 = Res: Thick Film Resistor -  0.005ohm, 1%, 0805
R?#3 = Res: Thick Film Resistor -  150Kohm, 1%, 0402
R?#5 R?#8 = Res: Thick Film Resistor -  100Kohm, 1%, 0402
R?#6 = Res: Thick Film Resistor -  18Kohm, 0.1%, 0402
R?#7 = Res: Thick Film Resistor -  0ohm, 1%, 0402
U? = MP8758H: IC REG BUCK ADJUSTABLE 10A 21QFN; Case/Package: QFN-21